# Altium project Sonar_Amp.PrjPcb
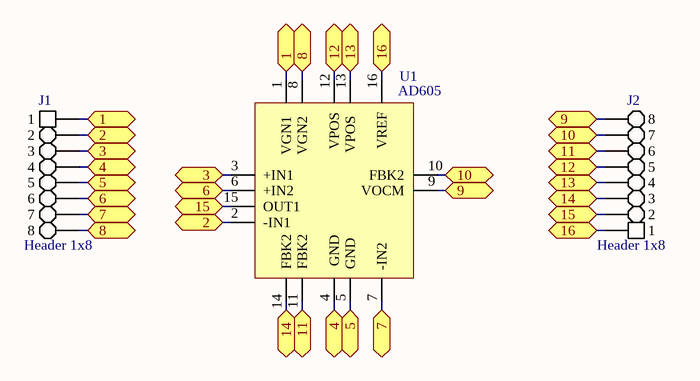
[diagram p0: Sonar_Amp_Sheet.SchDoc]
1 sheet, 3 parts. Net scope: flat (ports and power ports of the same name join across sheets).
Board file: Sonar_Amp_Mcu_PCB.PcbDoc

## Sheet Sonar_Amp_Sheet.SchDoc
size A3; SheetNumber: 1; SheetTotal: 1

### Parts
J1  Header 1x8  [Header 1x8]
J2  Header 1x8  [Header 1x8]
U1  AD605  [SOIC127P600X175-16N]

### Ports
1 (bidir), 2 (bidir), 3 (bidir), 4 (bidir), 5 (bidir), 6 (bidir), 7 (bidir), 8 (bidir), 9 (bidir), 10 (bidir), 11 (bidir), 12 (bidir), 13 (bidir), 14 (bidir), 15 (bidir), 16 (bidir)

### Nets
NetJ1_1: J1.1 U1.1(VGN1) ; port 1
NetJ1_2: J1.2 U1.2(-IN1) ; port 2
NetJ1_3: J1.3 U1.3(+IN1) ; port 3
NetJ1_4: J1.4 U1.4(GND) ; port 4
NetJ1_5: J1.5 U1.5(GND) ; port 5
NetJ1_6: J1.6 U1.6(+IN2) ; port 6
NetJ1_7: J1.7 U1.7(-IN2) ; port 7
NetJ1_8: J1.8 U1.8(VGN2) ; port 8
NetJ2_1: J2.1 U1.16(VREF) ; port 16
NetJ2_2: J2.2 U1.15(OUT1) ; port 15
NetJ2_3: J2.3 U1.14(FBK2) ; port 14
NetJ2_4: J2.4 U1.13(VPOS) ; port 13
NetJ2_5: J2.5 U1.12(VPOS) ; port 12
NetJ2_6: J2.6 U1.11(FBK2) ; port 11
NetJ2_7: J2.7 U1.10(FBK2) ; port 10
NetJ2_8: J2.8 U1.9(VOCM) ; port 9

### Library data of the parts
J1 J2 = Header 1x8: Header; ComponentLink3Description: Satın Alma Linki; ComponentLink3URL: https://www.robotistan.com/1x40-180-12mm
U1 = AD605: ComponentLink1Description: Satın Alma Linki; ComponentLink1URL: https://karakoyelektronik.com/entegre-opamp/ad605arz-ad605-soic-16-smd-entegre-73227; ComponentLink2Description: Datasheet; ComponentLink2URL: https://www.analog.com/media/en/technical-documentation/data-sheets/ad605.pdf